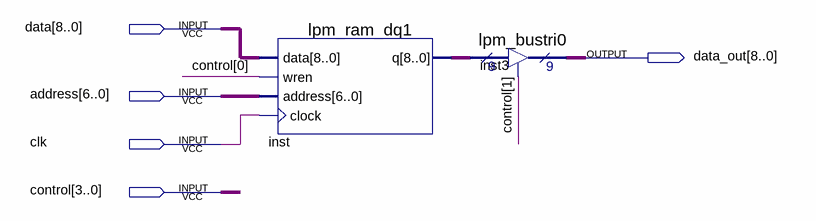
[diagram p0: schematic sheet]
// Quartus schematic RAM.bdf as structural Verilog: 2 symbols, 5 pins
module RAM (
  input  [8:0] data,
  input  [6:0] address,
  input  clk,
  input  [3:0] control,
  output [8:0] data_out
);

  wire [8:0] inst_q;

  lpm_ram_dq1 inst (.data(data), .wren(control[0]), .address(address), .clock(clk), .q(inst_q));
  lpm_bustri0 inst3 (.enabledt(control[1]), .data(inst_q), .tridata(data_out));
endmodule
